# Altium schematic sheet Top Level.SchDoc
size A4
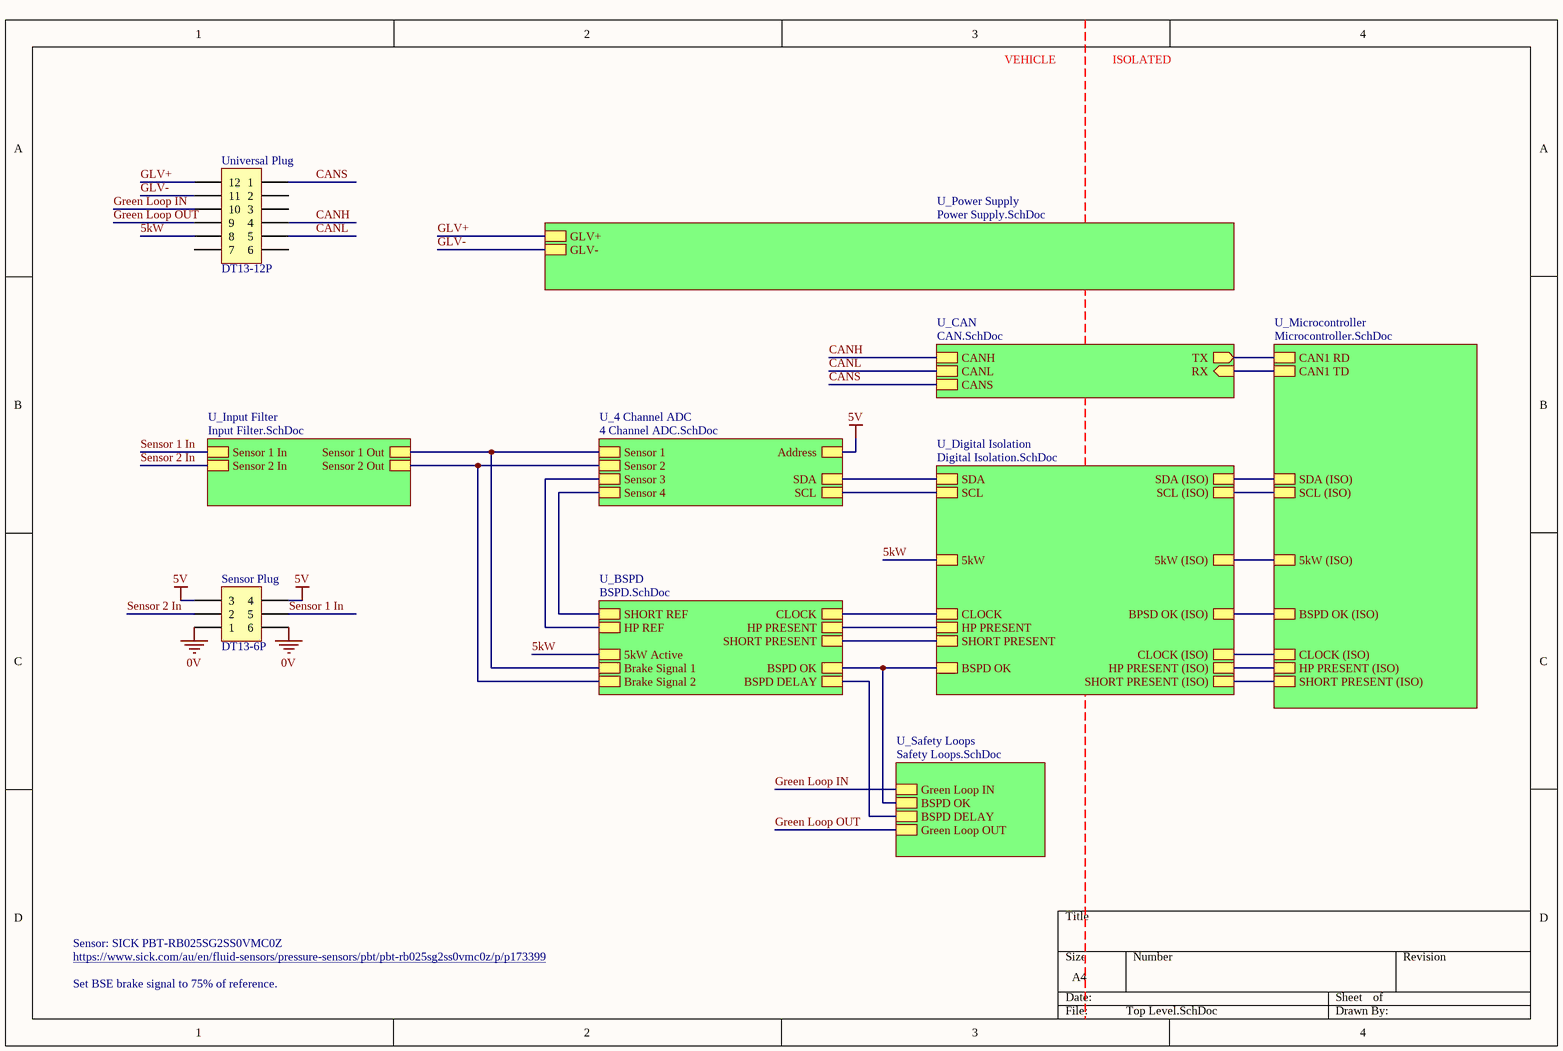
[diagram p0: Top Level.SchDoc]

## Parts
Sensor_Plug  DT13-6P  [DT13-6P]
Universal_Plug  DT13-12P  [DT13-12P]

## Sub-sheets
U_4 Channel ADC = 4 Channel ADC.SchDoc: Address, SCL, SDA, Sensor 1, Sensor 2, Sensor 3, Sensor 4
U_BSPD = BSPD.SchDoc: BSPD OK, HP PRESENT, SHORT PRESENT, CLOCK, HP REF, SHORT REF, 5kW Active, Brake Signal 1, Brake Signal 2, BSPD DELAY
U_CAN = CAN.SchDoc: CANS, RX (in), CANL, CANH, TX (out)
U_Digital Isolation = Digital Isolation.SchDoc: SDA (ISO), SCL (ISO), SDA, SCL, CLOCK (ISO), HP PRESENT (ISO), SHORT PRESENT (ISO), BPSD OK (ISO), 5kW, 5kW (ISO), BSPD OK, HP PRESENT, SHORT PRESENT, CLOCK
U_Input Filter = Input Filter.SchDoc: Sensor 1 In, Sensor 1 Out, Sensor 2 In, Sensor 2 Out
U_Microcontroller = Microcontroller.SchDoc: BSPD OK (ISO), 5kW (ISO), CLOCK (ISO), HP PRESENT (ISO), SHORT PRESENT (ISO), SDA (ISO), SCL (ISO), CAN1 RD, CAN1 TD
U_Power Supply = Power Supply.SchDoc: GLV+, GLV-
U_Safety Loops = Safety Loops.SchDoc: Green Loop OUT, Green Loop IN, BSPD OK, BSPD DELAY

## Nets
0V: Sensor_Plug.1 Sensor_Plug.6
5V: Sensor_Plug.3 Sensor_Plug.4 ; sheet U_4 Channel ADC/Address
5kW: Universal_Plug.8 ; sheet U_BSPD/5kW Active, sheet U_Digital Isolation/5kW
CANH: Universal_Plug.4 ; sheet U_CAN/CANH
CANL: Universal_Plug.5 ; sheet U_CAN/CANL
CANS: Universal_Plug.1 ; sheet U_CAN/CANS
GLV+: Universal_Plug.12 ; sheet U_Power Supply/GLV+
GLV-: Universal_Plug.11 ; sheet U_Power Supply/GLV-
Green Loop IN: Universal_Plug.10 ; sheet U_Safety Loops/Green Loop IN
Green Loop OUT: Universal_Plug.9 ; sheet U_Safety Loops/Green Loop OUT
Sensor 1 In: Sensor_Plug.5 ; sheet U_Input Filter/Sensor 1 In
Sensor 2 In: Sensor_Plug.2 ; sheet U_Input Filter/Sensor 2 In
(unnamed): sheet U_BSPD/BSPD OK, sheet U_Digital Isolation/BSPD OK, sheet U_Safety Loops/BSPD OK
(unnamed): sheet U_BSPD/HP PRESENT, sheet U_Digital Isolation/HP PRESENT
(unnamed): sheet U_BSPD/SHORT PRESENT, sheet U_Digital Isolation/SHORT PRESENT
(unnamed): sheet U_BSPD/CLOCK, sheet U_Digital Isolation/CLOCK
(unnamed): sheet U_BSPD/HP REF, sheet U_4 Channel ADC/Sensor 3
(unnamed): sheet U_BSPD/SHORT REF, sheet U_4 Channel ADC/Sensor 4
(unnamed): sheet U_BSPD/Brake Signal 1, sheet U_4 Channel ADC/Sensor 1, sheet U_Input Filter/Sensor 1 Out
(unnamed): sheet U_BSPD/Brake Signal 2, sheet U_4 Channel ADC/Sensor 2, sheet U_Input Filter/Sensor 2 Out
(unnamed): sheet U_BSPD/BSPD DELAY, sheet U_Safety Loops/BSPD DELAY
(unnamed): sheet U_4 Channel ADC/SCL, sheet U_Digital Isolation/SCL
(unnamed): sheet U_4 Channel ADC/SDA, sheet U_Digital Isolation/SDA
(unnamed): sheet U_Digital Isolation/SDA (ISO), sheet U_Microcontroller/SDA (ISO)
(unnamed): sheet U_Digital Isolation/SCL (ISO), sheet U_Microcontroller/SCL (ISO)
(unnamed): sheet U_Digital Isolation/CLOCK (ISO), sheet U_Microcontroller/CLOCK (ISO)
(unnamed): sheet U_Digital Isolation/HP PRESENT (ISO), sheet U_Microcontroller/HP PRESENT (ISO)
(unnamed): sheet U_Digital Isolation/SHORT PRESENT (ISO), sheet U_Microcontroller/SHORT PRESENT (ISO)
(unnamed): sheet U_Digital Isolation/BPSD OK (ISO), sheet U_Microcontroller/BSPD OK (ISO)
(unnamed): sheet U_Digital Isolation/5kW (ISO), sheet U_Microcontroller/5kW (ISO)
(unnamed): sheet U_Microcontroller/CAN1 RD, sheet U_CAN/TX
(unnamed): sheet U_Microcontroller/CAN1 TD, sheet U_CAN/RX

Not connected (* = marked no-connect by the designer): Universal_Plug 2 3 6 7

## Notes on the sheet
- VEHICLE
- ISOLATED
- Sensor: SICK PBT-RB025SG2SS0VMC0Z
- https://www.sick.com/au/en/fluid-sensors/pressure-sensors/pbt/pbt-rb025sg2ss0vmc0z/p/p173399
- Set BSE brake signal to 75% of reference.

## Library data of the parts
Sensor_Plug = DT13-6P[[/\]]DT13-6P: Positions: 6; Pitch: 4.44mm; Row Spacing: 6.35mm; Angle: 90; Flange: Yes; Contact: Copper Alloy; Part Number: DT13-6P; Digikey Part Number: 1734-1025-ND; Digikey Link: https://www.digikey.com/product-detail/en/te-connectivity-deutsch-connectors/DT13-6P/1734-1025-ND/6566589
Universal_Plug = DT13-12P[[/\]]DT13-12P: Positions: 12; Pitch: 4.44mm; Row Spacing: 6.35mm; Angle: 90; Flange: Yes; Contact: Nickel; Part Number: DT13-12P; Digikey Part Number: 1734-1451-ND; Digikey Link: https://www.digikey.com.au/product-detail/en/te-connectivity-deutsch-connectors/DT13-12PA/1734-1451-ND/7220123